# EAGLE design display (EAGLE 7.4.0)
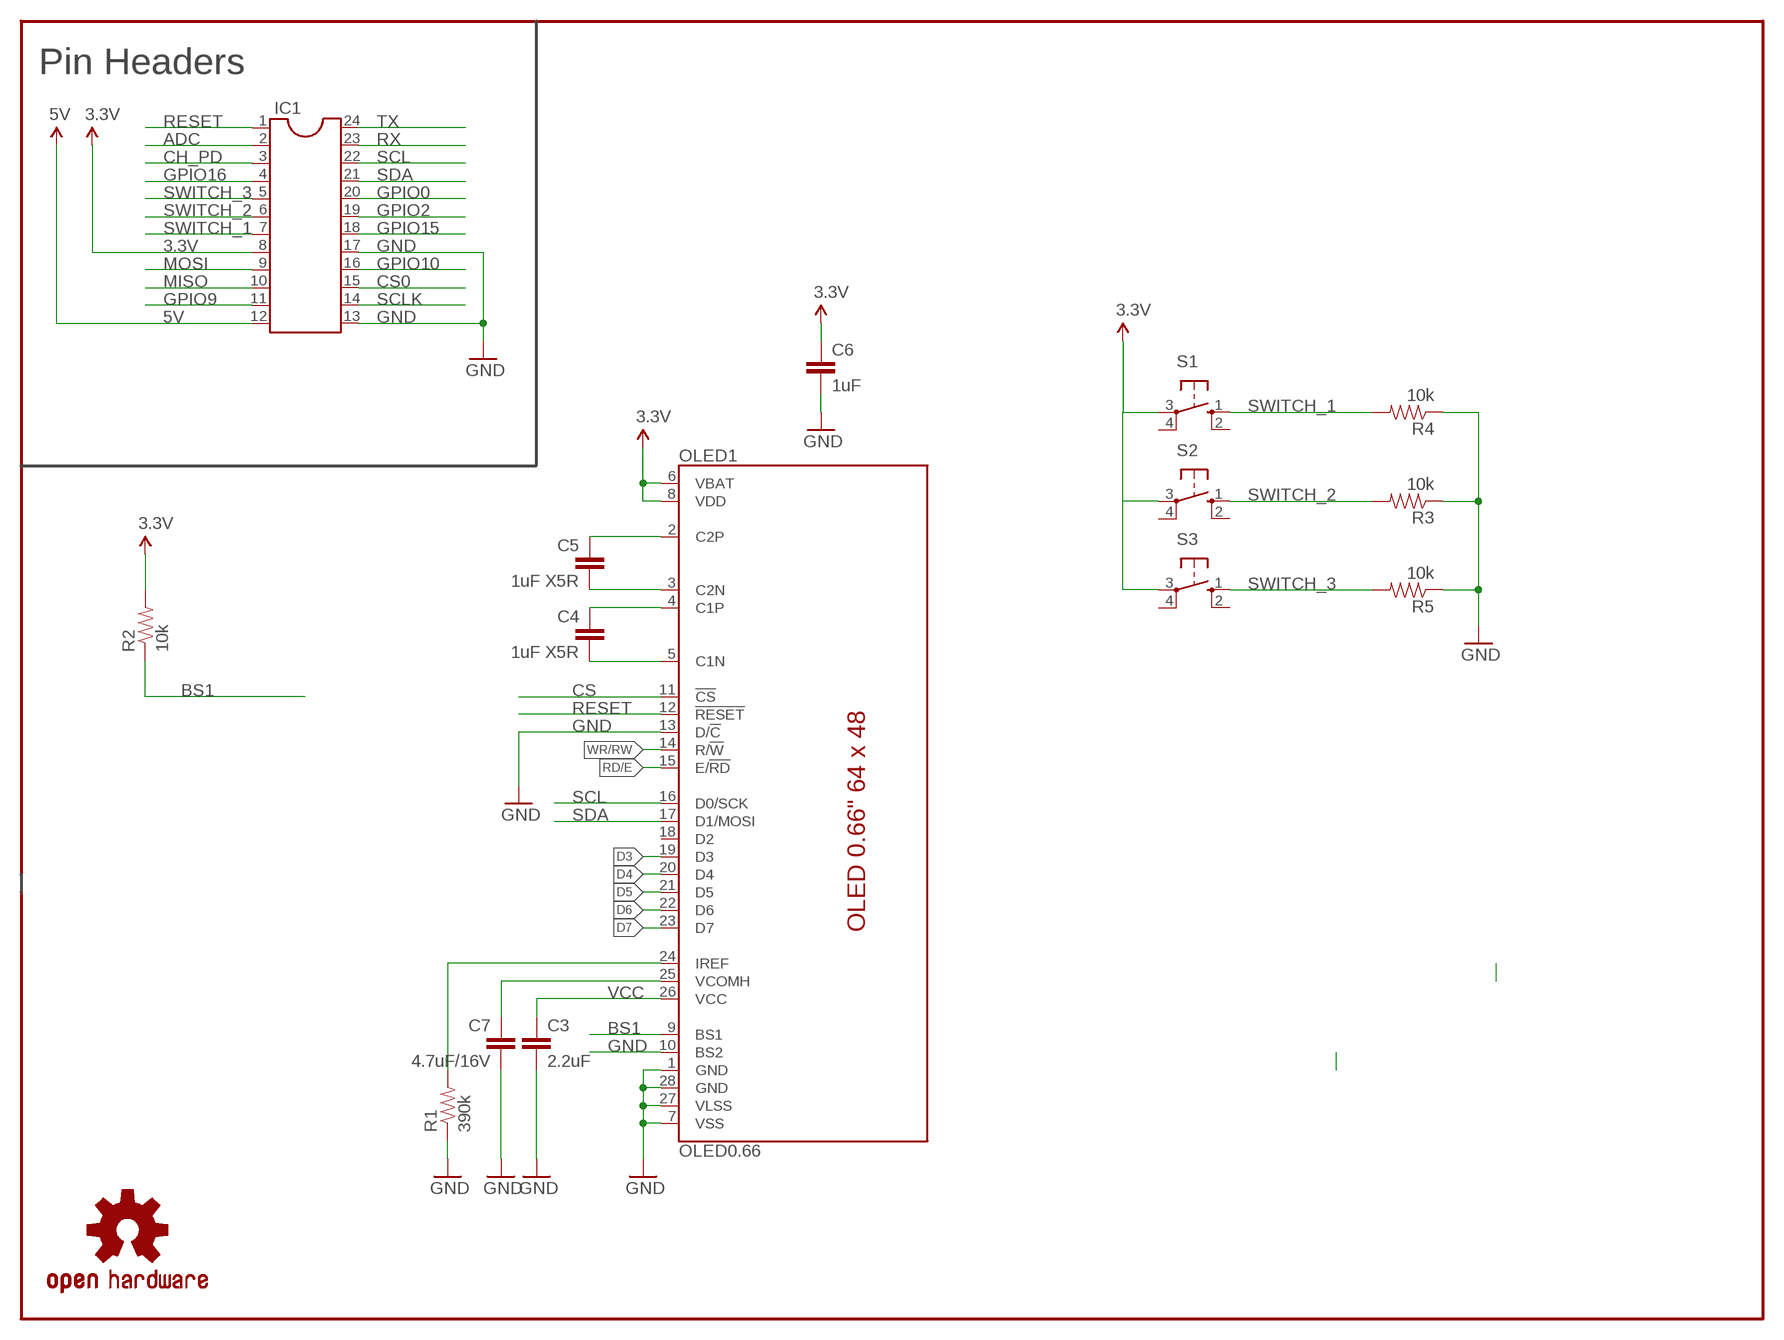
[diagram p0: schematic, sheet 1]

## Parts
C3  2.2uF  CAP1206  [1206]
C4  1uF X5R  CAP1206  [1206]
C5  1uF X5R  CAP1206  [1206]
C6  1uF  CAP1206  [1206]
C7  4.7uF/16V  CAP1206  [1206]
FRAME1  FRAME-LETTERNO_PACKAGE  [DUMMY]
IC1  DIL24-9  [DIL24-9]
LOGO1  OSHW-LOGOS  [OSHW-LOGO-S]
OLED1  OLED0.66  [OLED-0.66-64X48]
R1  390k  RESISTOR1206  [1206]
R2  10k  RESISTOR1206  [1206]
R3  10k  RESISTOR1206  [1206]
R4  10k  RESISTOR1206  [1206]
R5  10k  RESISTOR1206  [1206]
S1  10-XX  [B3F-10XX]
S2  10-XX  [B3F-10XX]
S3  10-XX  [B3F-10XX]

## Nets
3.3V: C6.1 IC1.8 OLED1.6(VBAT) OLED1.8(VDD) R2.2 S1.3(P) S2.3(P) S3.3(P)
5V: IC1.12
ADC: IC1.2
BS1: OLED1.9(BS1) R2.1
C1N: C4.2 OLED1.5(C1N)
C1P: C4.1 OLED1.4(C1P)
C2N: C5.2 OLED1.3(C2N)
C2P: C5.1 OLED1.2(C2P)
CH_PD: IC1.3
CS: OLED1.11(!CS!)
CS0: IC1.15
D3: OLED1.19(D3)
D4: OLED1.20(D4)
D5: OLED1.21(D5)
D6: OLED1.22(D6)
D7: OLED1.23(D7)
GND: C3.2 C6.2 C7.2 IC1.13 IC1.17 OLED1.1(GND) OLED1.7(VSS) OLED1.10(BS2) OLED1.13(D/!C!) OLED1.27(VLSS) OLED1.28(GND) R1.1 R3.1 R4.1 R5.1
GPIO0: IC1.20
GPIO2: IC1.19
GPIO9: IC1.11
GPIO10: IC1.16
GPIO15: IC1.18
GPIO16: IC1.4
IREF: OLED1.24(IREF) R1.2
MISO: IC1.10
MOSI: IC1.9
RD/E: OLED1.15(E/!RD!)
RESET: IC1.1 OLED1.12(!RESET!)
RX: IC1.23
SCL: IC1.22 OLED1.16(D0/SCK)
SCLK: IC1.14
SDA: IC1.21 OLED1.17(D1/MOSI)
SWITCH_1: IC1.7 R4.2 S1.1(S)
SWITCH_2: IC1.6 R3.2 S2.1(S)
SWITCH_3: IC1.5 R5.2 S3.1(S)
TX: IC1.24
VCC: C3.1 OLED1.26(VCC)
VCOMH: C7.1 OLED1.25(VCOMH)
WR/RW: OLED1.14(R/!W!)
Unconnected: OLED1.18(D2) S1.2(S1) S1.4(P1) S2.2(S1) S2.4(P1) S3.2(S1) S3.4(P1)

## Notes on the sheet
- Pin Headers

## Library data of the parts
C3-C7 = SparkFun-Passives:CAP: Capacitor Standard 0603 ceramic capacitor, and 0.1" leaded capacitor.
FRAME1 = SparkFun-Aesthetics:FRAME-LETTER: Schematic Frame Standard 8.5x11 US Letter frame; DESIGNER: Nobody; VERSION: v01
IC1 = ic-package:DIL24: Dual In Line
LOGO1 = SparkFun-Aesthetics:OSHW-LOGO: Open Source Hardware Logo This logo indicates the piece of hardware it is found on incorporates a OSHW license and/or adheres to the definition of open source hardware found here: http://freedomdefined.org/OSHW
OLED1 = microView-temp:OLED0.66
R1-R5 = SparkFun-Passives:RESISTOR: Resistor Basic schematic elements and footprints for 0603, 1206, and PTH resistors.
S1-S3 = switch-omron:10-XX: OMRON SWITCH; MPN: B3F-1000; OC_FARNELL: 176432; OC_NEWARK: 36M3542

## Net classes
1 power: width 0.254 mm

## Board
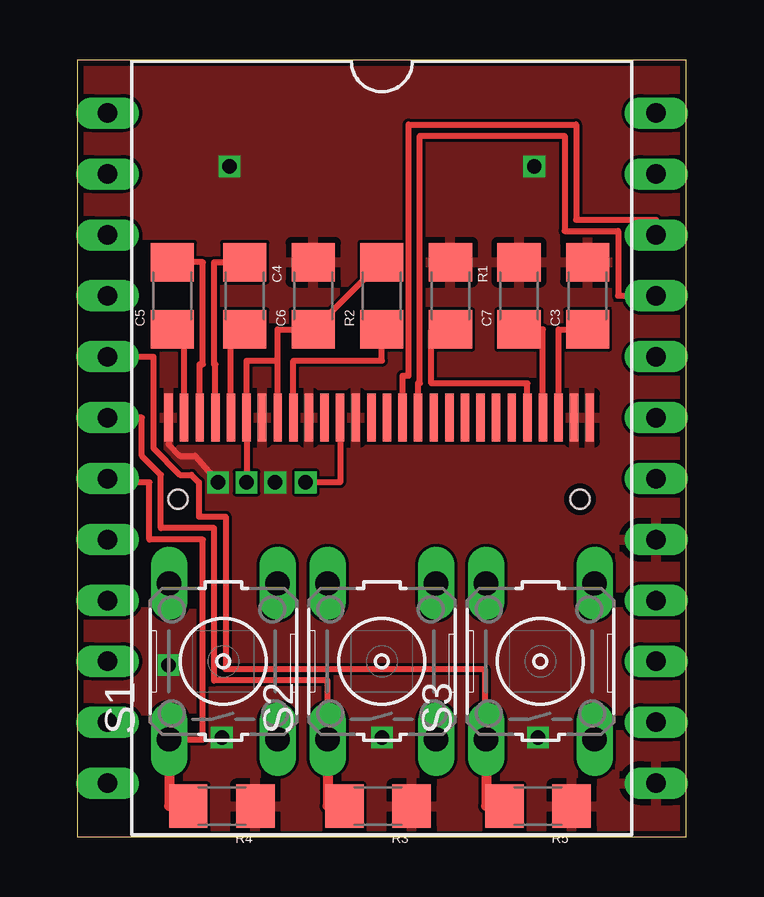
[diagram p1: board, top side]
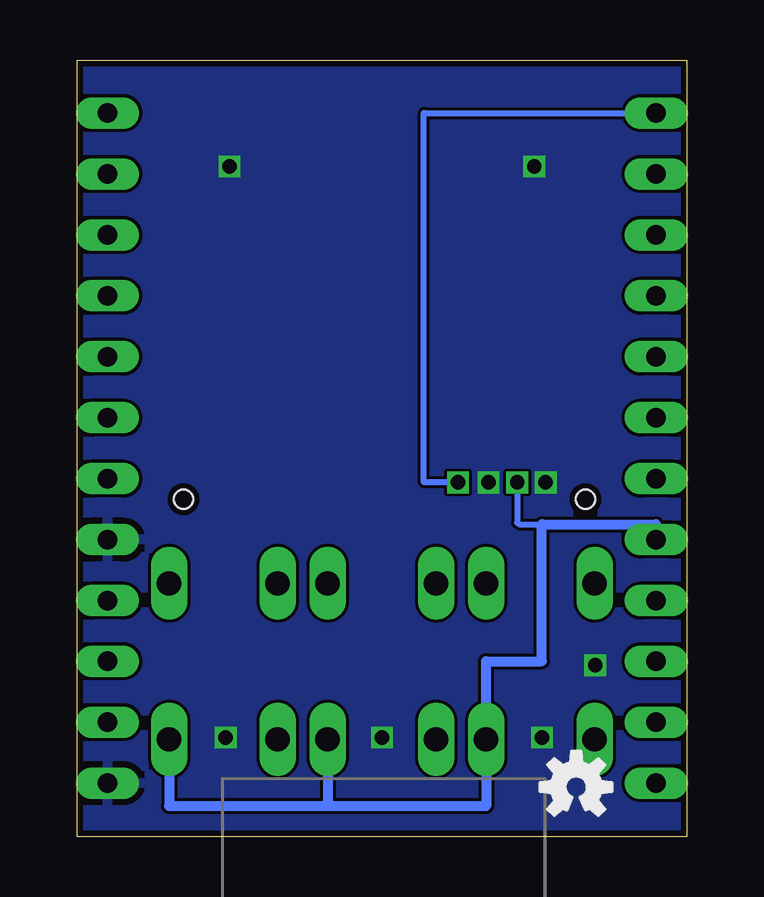
[diagram p2: board, bottom side, seen from below]

Size 25.39 x 32.38 mm. Coordinates in mm from the lower left corner, seen from the top.
Outline: 0,0 25.39,0 25.39,32.38 0,32.38 0,0
Copper layers (1*16): Top 0.035mm / dielectric 1.5mm / Bottom 0.035mm
Design rules "dirtypcbs": minimum track width 5mil, minimum drill 12mil, track to track 5mil, track to pad 5mil, pad to pad 5mil, via to via 5mil, smd to smd 0mil, copper to edge 10mil, drill to drill 10mil, minimum pad ring 10mil, minimum via ring 6mil, stop-mask expansion 2mil, vias tented up to drill 25mil, thermal gap 10mil

### Footprints (pad centres in the part's own frame; a part is rotated, then mirrored left to right if it is on the bottom)
1206 = smd 1.6 x 1.8: 1 -1.4,0; 2 1.4,0
DIL24-9 = drill 0.813 long: 1 -13.97,-11.43; 2 -11.43,-11.43; 3 -8.89,-11.43; 4 -6.35,-11.43; 5 -3.81,-11.43; 6 -1.27,-11.43; 7 1.27,-11.43; 8 3.81,-11.43; 9 6.35,-11.43; 10 8.89,-11.43; 11 11.43,-11.43; 12 13.97,-11.43; 13 13.97,11.43; 14 11.43,11.43; 15 8.89,11.43; 16 6.35,11.43; 17 3.81,11.43; 18 1.27,11.43; 19 -1.27,11.43; 20 -3.81,11.43; 21 -6.35,11.43; 22 -8.89,11.43; 23 -11.43,11.43; 24 -13.97,11.43
OLED-0.66-64X48 = smd 0.35 x 2: 1 0,0; 2 0.65,0; 3 1.3,0; 4 1.95,0; 5 2.6,0; 6 3.25,0; 7 3.9,0; 8 4.55,0; 9 5.2,0; 10 5.85,0; 11 6.5,0; 12 7.15,0; 13 7.8,0; 14 8.45,0; 15 9.1,0; 16 9.75,0; 17 10.4,0; 18 11.05,0; 19 11.7,0; 20 12.35,0; 21 13,0; 22 13.65,0; 23 14.3,0; 24 14.95,0; 25 15.6,0; 26 16.25,0; 27 16.9,0; 28 17.55,0 | hole 0.8: 17.15,-3.4; 0.4,-3.4
B3F-10XX = drill 1.016 long: 1 -3.251,2.261; 2 3.251,2.261; 3 -3.251,-2.261; 4 3.251,-2.261

### Placement (x,y rotation side)
C3  21.27,22.54 90 top
C4  6.99,22.54 270 top
C5  3.97,22.54 90 top
C6  9.84,22.54 90 top
C7  18.41,22.54 90 top
FRAME1  24.61,-5.08 0 top  (outside the outline)
IC1  12.7,16.19 270 top
LOGO1  4.6,2.06 0 bottom
OLED1  3.81,17.46 0 top
R1  15.56,22.54 270 top
R2  12.7,22.54 90 top
R3  12.54,1.27 180 top
R4  6.03,1.27 180 top
R5  19.21,1.27 180 top
S1  6.1,7.3 90 top
S2  12.7,7.3 90 top
S3  19.3,7.3 90 top

### Tracks (layer width: path | path; a pad name or v marks a point on that pad's centre or on a via)
3.3V  (via drill 0.6)
  Top 0.254: OLED1.8 8.36,19.84 | 8.36,19.84 8.36,21.14 C6.1 R2.2 | 8.36,19.84 7.06,19.84 OLED1.6 v7.06,14.76
  Bottom 0.254: v7.06,14.76 7.06,13.09 6.99,13.02 6.03,13.02
  Bottom 0.406: 14.96,1.27 8.36,1.27 S1.3 8.36,7.3 6.03,7.3 6.03,13.02 1.27,13.02 IC1.8 | 14.96,1.27 21.57,1.27 S3.3 | S2.3 14.96,1.27
BS1
  Top 0.254: OLED1.9 9.01,19.84 12.7,19.84 R2.1
C1N
  Top 0.254: OLED1.5 6.41,21.14 C4.2
C1P
  Top 0.254: OLED1.4 5.76,19.68 5.71,19.68 5.71,23.94 C4.1
C2N
  Top 0.254: OLED1.3 5.11,19.68 5.24,19.68 5.24,23.94 C5.2
C2P
  Top 0.254: OLED1.2 4.46,21.14 C5.1
GND  (via drill 0.6)
  Top 0.254: OLED1.1 3.81,16.35 4.29,15.88 4.92,15.88 v5.87,14.76
  other vias: 8.26,14.76 6.35,27.94 19.05,27.94 6.03,4.13 12.7,4.13 19.21,4.13 3.81,7.14
  pour Bottom: 0,0 25.4,0 25.4,32.38 0,32.38
  pour Top: 0,0 25.4,0 25.4,32.38 0,32.38
IREF
  Top 0.254: OLED1.24 18.76,18.89 14.76,18.89 14.76,21.11 R1.2
RESET  (via drill 0.6)
  Top 0.254: OLED1.12 10.96,14.76 v9.53,14.76
  Bottom 0.254: v9.53,14.76 10.95,14.76 10.95,30.16 IC1.1
SCL
  Top 0.254: OLED1.16 13.56,19.21 13.81,19.21 13.81,29.69 20.8,29.69 20.8,25.72 24.13,25.72 IC1.22
SDA
  Top 0.254: OLED1.17 14.21,18.89 14.29,18.89 14.29,29.21 20.32,29.21 20.32,25.24 22.54,25.24 22.54,22.54 IC1.21
SWITCH_1
  Top 0.254: S1.1 5.24,4.05 5.24,12.38 3.02,12.38 3.02,14.76 1.27,14.76 IC1.7
  Top 0.406: S1.1 3.83,1.27 R4.2
SWITCH_2
  Top 0.254: S2.1 10.44,6.51 5.71,6.51 5.71,12.86 3.49,12.86 3.49,15.08 2.7,15.88 2.7,17.46 IC1.6
  Top 0.406: S2.1 10.44,1.27 R3.2
SWITCH_3
  Top 0.254: IC1.5 3.17,20 3.17,16.19 4.29,15.08 4.76,15.08 5.08,14.76 5.08,13.34 6.19,13.34 6.19,6.99 16.99,6.99 16.99,4.05 S3.1
  Top 0.406: S3.1 17.04,1.27 R5.2
VCC
  Top 0.254: OLED1.26 20.06,21.14 C3.1
VCOMH
  Top 0.254: OLED1.25 19.41,21.14 C7.1